# Altium schematic sheet Antenna.SchDoc
size A
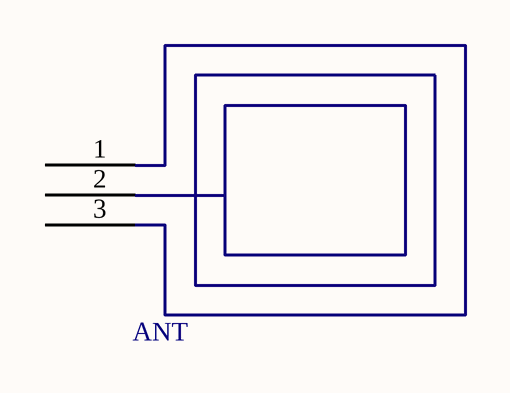
[diagram p0: Antenna.SchDoc]

## Parts
ANT  Antenna 13.56MHz  [Antenna-13.56MHz]  (value not drawn)

## Nets

Not connected (* = marked no-connect by the designer): ANT 1 2 3

## Library data of the parts
ANT = Antenna-13.56MHz